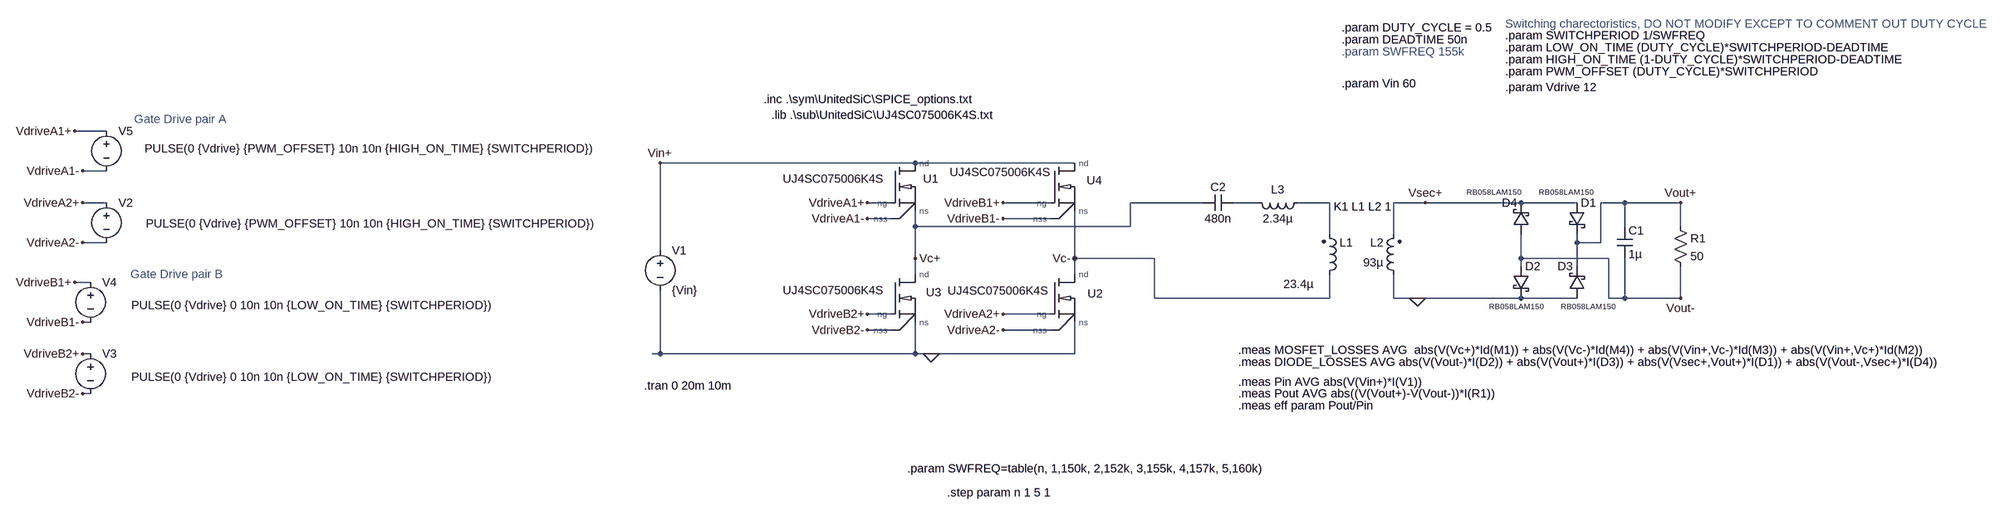
[diagram p0: schematic resonant_full_bridge.asc]
resonant_full_bridge.asc, the LTspice schematic file:
Version 4
SHEET 1 2776 680
WIRE -2768 -1168 -2832 -1168
WIRE -1008 -1104 -1520 -1104
WIRE -688 -1104 -1008 -1104
WIRE -2768 -1088 -2816 -1088
WIRE -2768 -1024 -2816 -1024
WIRE -1056 -1024 -1104 -1024
WIRE -736 -1024 -832 -1024
WIRE -432 -1024 -576 -1024
WIRE -320 -1024 -368 -1024
WIRE -176 -1024 -240 -1024
WIRE 16 -1024 -48 -1024
WIRE 208 -1024 16 -1024
WIRE 320 -1024 208 -1024
WIRE 416 -1024 368 -1024
WIRE 528 -1024 416 -1024
WIRE -1056 -992 -1104 -992
WIRE -736 -992 -832 -992
WIRE -1008 -976 -1008 -1008
WIRE -576 -976 -576 -1024
WIRE -576 -976 -1008 -976
WIRE 416 -976 416 -1024
WIRE 528 -976 528 -1024
WIRE -176 -960 -176 -1024
WIRE -48 -960 -48 -1024
WIRE -2768 -944 -2816 -944
WIRE 320 -944 320 -960
WIRE 368 -944 368 -1024
WIRE 368 -944 320 -944
WIRE -1520 -928 -1520 -1104
WIRE -1008 -912 -1008 -976
WIRE -688 -912 -688 -1008
WIRE -528 -912 -688 -912
WIRE 208 -912 208 -960
WIRE 384 -912 208 -912
WIRE 208 -896 208 -912
WIRE 320 -896 320 -944
WIRE -1008 -880 -1008 -912
WIRE -688 -880 -688 -912
WIRE -2800 -864 -2832 -864
WIRE -528 -832 -528 -912
WIRE -176 -832 -176 -880
WIRE -176 -832 -528 -832
WIRE -48 -832 -48 -880
WIRE 0 -832 -48 -832
WIRE 208 -832 0 -832
WIRE 320 -832 208 -832
WIRE 384 -832 384 -912
WIRE 416 -832 416 -912
WIRE 416 -832 384 -832
WIRE 528 -832 528 -896
WIRE 528 -832 416 -832
WIRE -1056 -800 -1104 -800
WIRE -736 -800 -832 -800
WIRE -2800 -784 -2816 -784
WIRE -1056 -768 -1104 -768
WIRE -736 -768 -832 -768
WIRE -2800 -720 -2816 -720
WIRE -1520 -720 -1520 -848
WIRE -1520 -720 -1536 -720
WIRE -1008 -720 -1008 -784
WIRE -1008 -720 -1520 -720
WIRE -976 -720 -1008 -720
WIRE -688 -720 -688 -784
WIRE -688 -720 -976 -720
WIRE -2800 -640 -2816 -640
FLAG -976 -720 0
FLAG 0 -832 0
FLAG -1520 -1104 Vin+
FLAG 528 -1024 Vout+
FLAG 528 -832 Vout-
FLAG -1008 -912 Vc+
FLAG -1104 -1024 VdriveA1+
FLAG -688 -912 Vc-
FLAG -2816 -1088 VdriveA1-
FLAG -2832 -1168 VdriveA1+
FLAG 16 -1024 Vsec+
FLAG -1104 -992 VdriveA1-
FLAG -832 -800 VdriveA2+
FLAG -832 -768 VdriveA2-
FLAG -1104 -800 VdriveB2+
FLAG -1104 -768 VdriveB2-
FLAG -832 -1024 VdriveB1+
FLAG -832 -992 VdriveB1-
FLAG -2816 -1024 VdriveA2+
FLAG -2816 -944 VdriveA2-
FLAG -2832 -864 VdriveB1+
FLAG -2816 -784 VdriveB1-
FLAG -2816 -720 VdriveB2+
FLAG -2816 -640 VdriveB2-
SYMBOL voltage -1520 -944 R0
WINDOW 123 0 0 Left 0
WINDOW 39 0 0 Left 0
SYMATTR InstName V1
SYMATTR Value {Vin}
SYMBOL res 512 -992 R0
SYMATTR InstName R1
SYMATTR Value 50
SYMBOL schottky 304 -1024 R0
WINDOW 3 -60 -21 Left 1
SYMATTR Value RB058LAM150
SYMATTR InstName D1
SYMATTR Description Diode
SYMATTR Type diode
SYMBOL cap 400 -976 R0
SYMATTR InstName C1
SYMATTR Value 1µ
SYMBOL cap -368 -1040 R90
WINDOW 0 0 32 VBottom 2
WINDOW 3 32 32 VTop 2
SYMATTR InstName C2
SYMATTR Value 480n
SYMBOL ind2 -192 -864 M180
WINDOW 0 36 80 Left 2
WINDOW 3 -77 -4 Left 2
SYMATTR InstName L1
SYMATTR Value 23.4µ
SYMATTR Type ind
SYMBOL ind2 -32 -864 R180
WINDOW 0 36 80 Left 2
WINDOW 3 36 40 Left 2
SYMATTR InstName L2
SYMATTR Value 93µ
SYMATTR Type ind
SYMBOL ind -224 -1040 R90
WINDOW 0 5 56 VBottom 2
WINDOW 3 32 56 VTop 2
SYMATTR InstName L3
SYMATTR Value 2.34µ
SYMBOL voltage -2768 -1040 R0
WINDOW 3 79 58 Left 2
WINDOW 123 0 0 Left 0
WINDOW 39 0 0 Left 0
SYMATTR Value PULSE(0 {Vdrive} {PWM_OFFSET} 10n 10n {HIGH_ON_TIME} {SWITCHPERIOD})
SYMATTR InstName V2
SYMBOL voltage -2800 -736 R0
WINDOW 3 82 62 Left 2
WINDOW 123 0 0 Left 0
WINDOW 39 0 0 Left 0
SYMATTR Value PULSE(0 {Vdrive} 0 10n 10n {LOW_ON_TIME} {SWITCHPERIOD})
SYMATTR InstName V3
SYMBOL schottky 224 -960 R180
WINDOW 0 24 64 Left 2
WINDOW 3 16 85 Left 1
SYMATTR InstName D4
SYMATTR Value RB058LAM150
SYMATTR Description Diode
SYMATTR Type diode
SYMBOL schottky 192 -896 R0
WINDOW 3 96 81 Left 1
SYMATTR Value RB058LAM150
SYMATTR InstName D2
SYMATTR Description Diode
SYMATTR Type diode
SYMBOL schottky 336 -832 R180
WINDOW 0 24 64 Left 2
WINDOW 3 83 -17 Left 1
SYMATTR InstName D3
SYMATTR Value RB058LAM150
SYMATTR Description Diode
SYMATTR Type diode
SYMBOL voltage -2800 -880 R0
WINDOW 3 82 62 Left 2
WINDOW 123 0 0 Left 0
WINDOW 39 0 0 Left 0
SYMATTR Value PULSE(0 {Vdrive} 0 10n 10n {LOW_ON_TIME} {SWITCHPERIOD})
SYMATTR InstName V4
SYMBOL voltage -2768 -1184 R0
WINDOW 3 77 51 Left 2
WINDOW 123 0 0 Left 0
WINDOW 39 0 0 Left 0
SYMATTR Value PULSE(0 {Vdrive} {PWM_OFFSET} 10n 10n {HIGH_ON_TIME} {SWITCHPERIOD})
SYMATTR InstName V5
SYMBOL UnitedSiC\\UnitedSiC_FET_4L -1056 -1104 R0
WINDOW 0 64 32 Left 2
WINDOW 3 -218 32 Left 2
SYMATTR InstName U1
SYMBOL UnitedSiC\\UnitedSiC_FET_4L -736 -880 R0
WINDOW 0 74 39 Left 2
WINDOW 3 -207 33 Left 2
SYMATTR InstName U2
SYMBOL UnitedSiC\\UnitedSiC_FET_4L -1056 -880 R0
WINDOW 0 70 36 Left 2
WINDOW 3 -218 32 Left 2
SYMATTR InstName U3
SYMBOL UnitedSiC\\UnitedSiC_FET_4L -736 -1104 R0
WINDOW 0 72 35 Left 2
WINDOW 3 -203 19 Left 2
SYMATTR InstName U4
TEXT -152 -1352 Left 2 !.param DEADTIME 50n
TEXT -152 -1328 Left 2 ;.param SWFREQ 155k
TEXT 176 -1360 Left 2 !.param SWITCHPERIOD 1/SWFREQ
TEXT 176 -1336 Left 2 !.param LOW_ON_TIME (DUTY_CYCLE)*SWITCHPERIOD-DEADTIME
TEXT 176 -1312 Left 2 !.param HIGH_ON_TIME (1-DUTY_CYCLE)*SWITCHPERIOD-DEADTIME
TEXT 176 -1288 Left 2 !.param PWM_OFFSET (DUTY_CYCLE)*SWITCHPERIOD
TEXT -152 -1264 Left 2 !.param Vin 60
TEXT -152 -1376 Left 2 !.param DUTY_CYCLE = 0.5
TEXT 176 -1384 Left 2 ;Switching charectoristics, DO NOT MODIFY EXCEPT TO COMMENT OUT DUTY CYCLE
TEXT -168 -1016 Left 2 !K1 L1 L2 1
TEXT 176 -1256 Left 2 !.param Vdrive 12
TEXT -1552 -656 Left 2 !.tran 0 20m 10m
TEXT -944 -408 Left 2 !.step param n 1 5 1
TEXT -1024 -456 Left 2 !.param SWFREQ=table(n, 1,150k, 2,152k, 3,155k, 4,157k, 5,160k)
TEXT -360 -664 Left 2 !.meas Pin AVG abs(V(Vin+)*I(V1))
TEXT -360 -640 Left 2 !.meas Pout AVG abs((V(Vout+)-V(Vout-))*I(R1))
TEXT -360 -616 Left 2 !.meas eff param Pout/Pin
TEXT -2712 -1192 Left 2 ;Gate Drive pair A
TEXT -2720 -880 Left 2 ;Gate Drive pair B
TEXT -360 -704 Left 2 !.meas DIODE_LOSSES AVG abs(V(Vout-)*I(D2)) + abs(V(Vout+)*I(D3)) + abs(V(Vsec+,Vout+)*I(D1)) + abs(V(Vout-,Vsec+)*I(D4))
TEXT -360 -728 Left 2 !.meas MOSFET_LOSSES AVG  abs(V(Vc+)*Id(M1)) + abs(V(Vc-)*Id(M4)) + abs(V(Vin+,Vc-)*Id(M3)) + abs(V(Vin+,Vc+)*Id(M2))
TEXT -1312 -1232 Left 2 !.inc .\\sym\\UnitedSiC\\SPICE_options.txt
TEXT -1296 -1200 Left 2 !.lib .\\sub\\UnitedSiC\\UJ4SC075006K4S.txt

The netlist it stands for:
* resonant_full_bridge.asc
V1 Vin+ 0 {Vin}
R1 Vout+ Vout- 50
D1 Vsec+ Vout+ RB058LAM150
C1 Vout+ Vout- 1µ
C2 N001 Vc+ 480n
L1 Vc- N002 23.4µ
L2 0 Vsec+ 93µ
L3 N002 N001 2.34µ
V2 VdriveA2+ VdriveA2- PULSE(0 {Vdrive} {PWM_OFFSET} 10n 10n {HIGH_ON_TIME} {SWITCHPERIOD})
V3 VdriveB2+ VdriveB2- PULSE(0 {Vdrive} 0 10n 10n {LOW_ON_TIME} {SWITCHPERIOD})
D4 Vout- Vsec+ RB058LAM150
D2 Vout- 0 RB058LAM150
D3 0 Vout+ RB058LAM150
V4 VdriveB1+ VdriveB1- PULSE(0 {Vdrive} 0 10n 10n {LOW_ON_TIME} {SWITCHPERIOD})
V5 VdriveA1+ VdriveA1- PULSE(0 {Vdrive} {PWM_OFFSET} 10n 10n {HIGH_ON_TIME} {SWITCHPERIOD})
XU1 Vin+ VdriveA1+ Vc+ VdriveA1- UJ4SC075006K4S  ; pins nd ng ns nss
XU2 Vc- VdriveA2+ 0 VdriveA2- UJ4SC075006K4S  ; pins nd ng ns nss
XU3 Vc+ VdriveB2+ 0 VdriveB2- UJ4SC075006K4S  ; pins nd ng ns nss
XU4 Vin+ VdriveB1+ Vc- VdriveB1- UJ4SC075006K4S  ; pins nd ng ns nss
.model D D
.lib standard.dio
.param DEADTIME 50n
* .param SWFREQ 155k
.param SWITCHPERIOD 1/SWFREQ
.param LOW_ON_TIME (DUTY_CYCLE)*SWITCHPERIOD-DEADTIME
.param HIGH_ON_TIME (1-DUTY_CYCLE)*SWITCHPERIOD-DEADTIME
.param PWM_OFFSET (DUTY_CYCLE)*SWITCHPERIOD
.param Vin 60
.param DUTY_CYCLE = 0.5
* Switching charectoristics, DO NOT MODIFY EXCEPT TO COMMENT OUT DUTY CYCLE
K1 L1 L2 1
.param Vdrive 12
.tran 0 20m 10m
.step param n 1 5 1
.param SWFREQ=table(n, 1,150k, 2,152k, 3,155k, 4,157k, 5,160k)
.meas Pin AVG abs(V(Vin+)*I(V1))
.meas Pout AVG abs((V(Vout+)-V(Vout-))*I(R1))
.meas eff param Pout/Pin
* Gate Drive pair A
* Gate Drive pair B
.meas DIODE_LOSSES AVG abs(V(Vout-)*I(D2)) + abs(V(Vout+)*I(D3)) + abs(V(Vsec+,Vout+)*I(D1)) + abs(V(Vout-,Vsec+)*I(D4))
.meas MOSFET_LOSSES AVG  abs(V(Vc+)*Id(M1)) + abs(V(Vc-)*Id(M4)) + abs(V(Vin+,Vc-)*Id(M3)) + abs(V(Vin+,Vc+)*Id(M2))
.inc .\sym\UnitedSiC\SPICE_options.txt
.lib .\sub\UnitedSiC\UJ4SC075006K4S.txt
.backanno
.end